# EAGLE design touch4 (EAGLE 7.2.0)
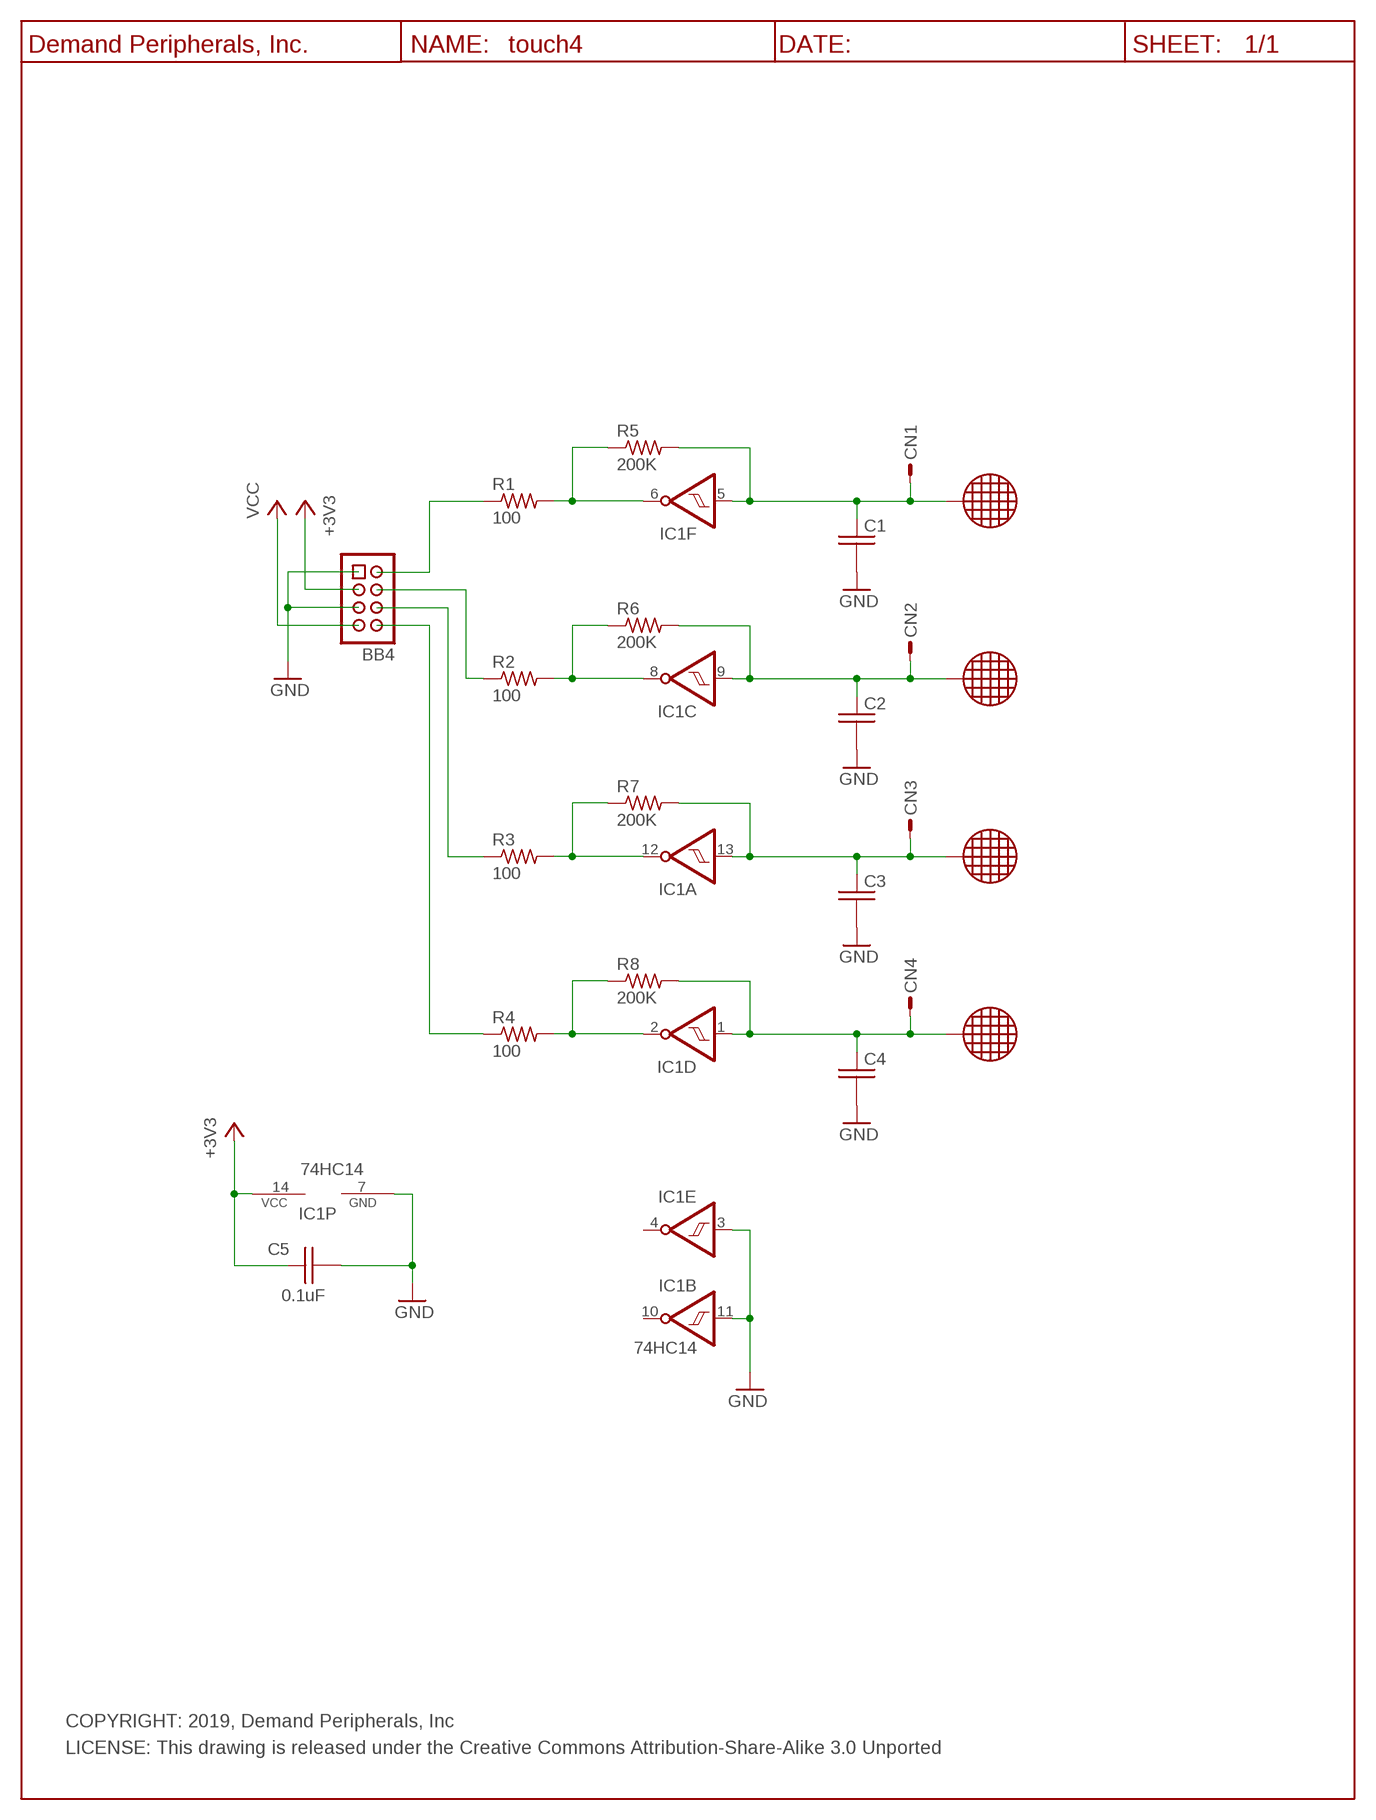
[diagram p0: schematic, sheet 1]

## Parts
BB4  BB_CON  HDR-4X2-SHR  [HDR-4X2]
C1  C33PF_C0603  [C0603]
C2  C33PF_C0603  [C0603]
C3  C33PF_C0603  [C0603]
C4  C33PF_C0603  [C0603]
C5  0.1uF  C0.1UF_C0603  [C0603]
CN1  PAD1  [PAD1]
CN2  PAD1  [PAD1]
CN3  PAD1  [PAD1]
CN4  PAD1  [PAD1]
IC1  74HC14  7414  [SO14]
R1  100  R100_R0603  [R0603]
R2  100  R100_R0603  [R0603]
R3  100  R100_R0603  [R0603]
R4  100  R100_R0603  [R0603]
R5  200K  R200K_R0603  [R0603]
R6  200K  R200K_R0603  [R0603]
R7  200K  R200K_R0603  [R0603]
R8  200K  R200K_R0603  [R0603]
U$1  DP_FRAME_P  [P_FRAME]
U$5  TOUCH-9MM  [TOUCH-9MM]
U$6  TOUCH-9MM  [TOUCH-9MM]
U$7  TOUCH-9MM  [TOUCH-9MM]
U$9  TOUCH-9MM  [TOUCH-9MM]

## Nets
+3V3: BB4.3 C5.1 IC1.14(P:VCC)
GND: BB4.1 BB4.5 C1.2 C2.2 C3.2 C4.2 C5.2 IC1.3(E:I) IC1.7(P:GND) IC1.11(B:I)
N$1: C3.1 CN3.1 IC1.13(A:I) R7.2 U$7.1
N$2: BB4.8 R4.1
N$3: BB4.2 R1.1
N$4: BB4.4 R2.1
N$7: BB4.6 R3.1
N$8: IC1.6(F:O) R1.2 R5.1
N$9: IC1.8(C:O) R2.2 R6.1
N$10: IC1.12(A:O) R3.2 R7.1
N$11: IC1.2(D:O) R4.2 R8.1
N$12: C4.1 CN4.1 IC1.1(D:I) R8.2 U$9.1
N$13: C1.1 CN1.1 IC1.5(F:I) R5.2 U$5.1
N$14: C2.1 CN2.1 IC1.9(C:I) R6.2 U$6.1
VCC: BB4.7
Unconnected: IC1.4(E:O) IC1.10(B:O)

## Notes on the sheet
- COPYRIGHT: 2019, Demand Peripherals, Inc
- LICENSE: This drawing is released under the Creative Commons Attribution-Share-Alike 3.0 Unported

## Library data of the parts
BB4 = dpi-conn:HDR-4X2-SHR: Shrouded 4x2 pin header; VENDOR: Digikey; VENDOR-PART-NUM: 609-3530-ND
C1-C4 = dpi-passive:C33PF_: 33 pF Capacitor, 50V; VENDOR: Digikey; VENDOR-PART-NUM: 1276-1070-2-ND
C5 = dpi-passive:C0.1UF_: 0.1 uF Capacitor, 25V, X7R; VENDOR: Digikey; VENDOR-PART-NUM: 1276-1126-2-ND
CN1-CN4 = dpi-conn:PAD1: WW PAD
IC1 = dpi-transic:74*14: Hex schmitt trigger INVERTER; VENDOR: Digikey; VENDOR-PART-NUM: 568-1401-1-ND
R1-R4 = dpi-passive:R100_: 100 Ohm resistor, 1%, 0.1 watt; VENDOR: Digikey; VENDOR-PART-NUM: 311-100HRTR-ND
R5-R8 = dpi-passive:R200K_: 200K Resistor, 1%, 0.1 watt; VENDOR: Digikey; VENDOR-PART-NUM: 311-200KHRTR-ND
U$1 = dpi-sym:DP_FRAME_P: Portrait/Letter Document Frame
U$5-U$7 U$9 = dpi-swsens:TOUCH-9MM: Touch Pad - 9mm

## Board
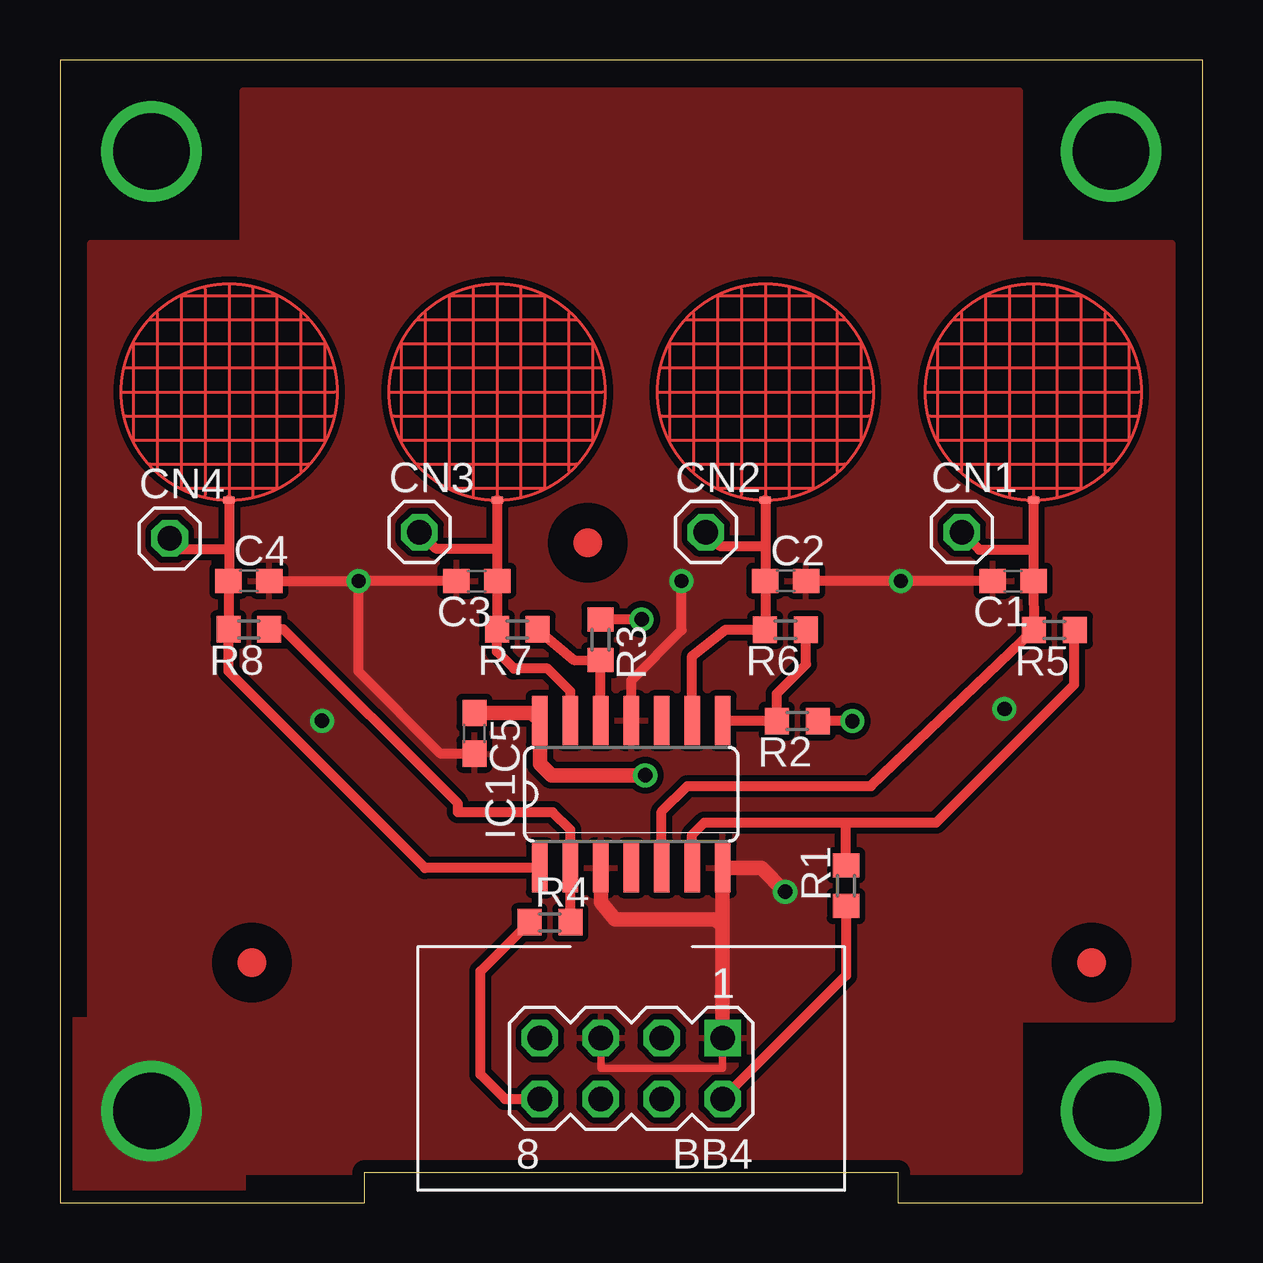
[diagram p1: board, top side]
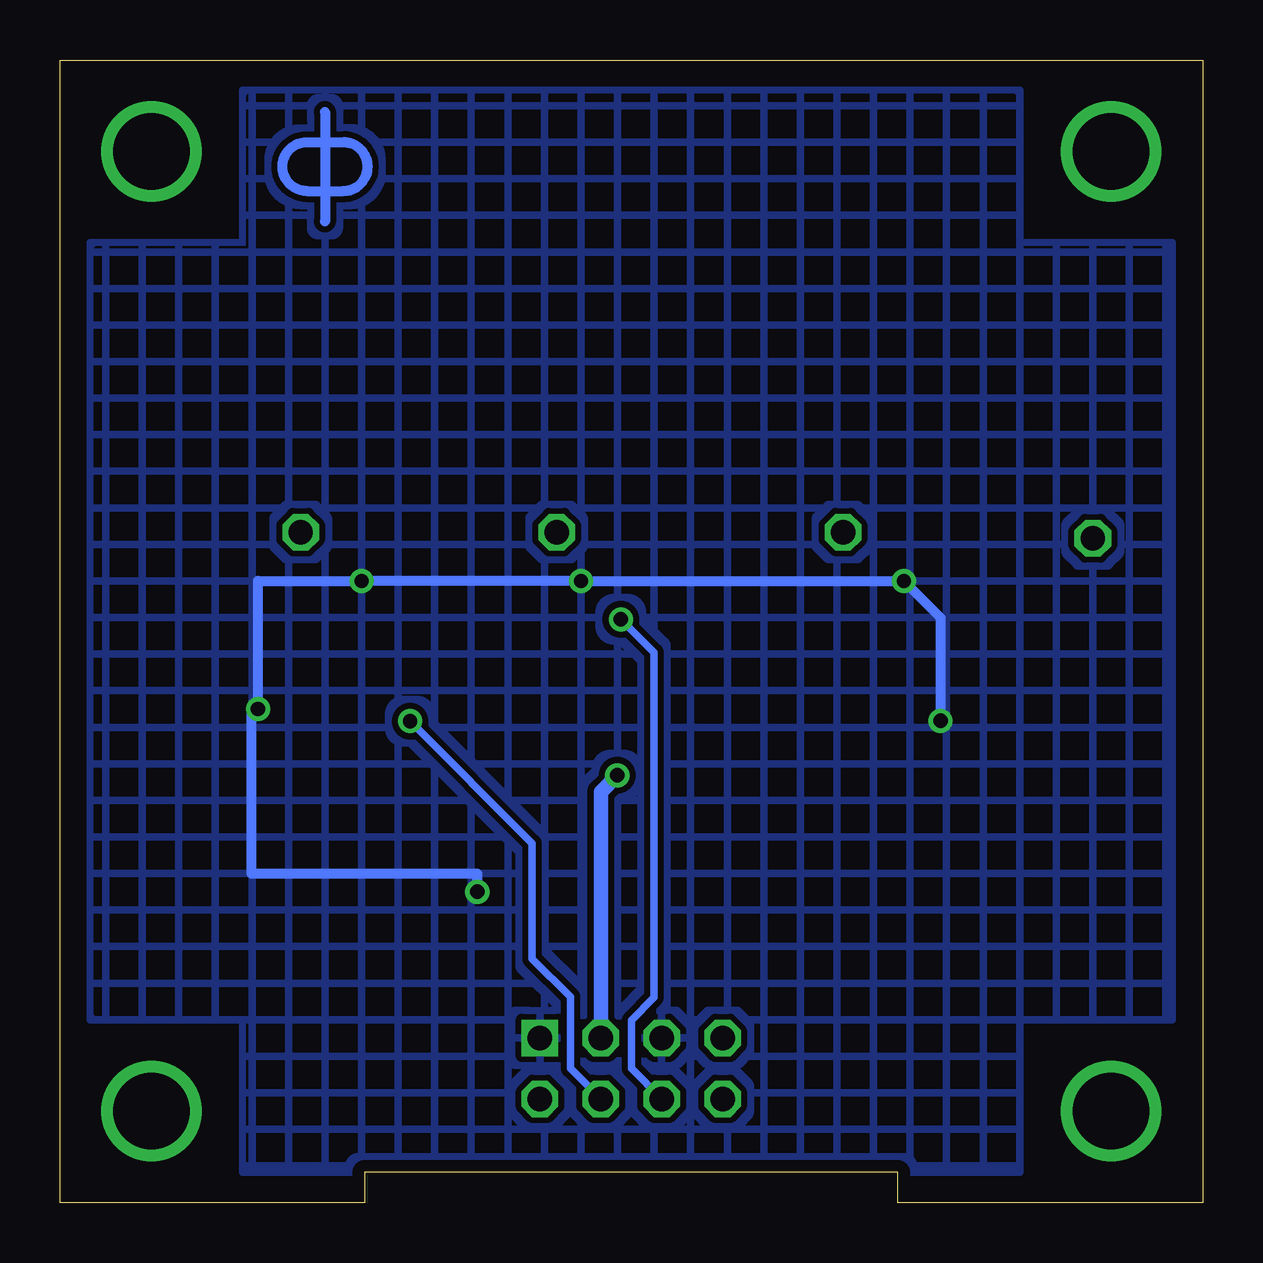
[diagram p2: board, bottom side, seen from below]

Size 47.62 x 47.62 mm. Coordinates in mm from the lower left corner, seen from the top.
Outline: 0,0 12.7,0 12.7,1.27 34.92,1.27 34.92,0 47.62,0 47.62,47.62 0,47.62 0,0
Copper layers (1*16): Top 0.035mm / dielectric 1.5mm / Bottom 0.035mm
Design rules "default *": minimum track width 10mil, minimum drill 20mil, track to track 10mil, track to pad 10mil, pad to pad 10mil, via to via 10mil, smd to smd 10mil, copper to edge 20mil, drill to drill 8mil, minimum pad ring 10mil, minimum via ring 8mil, stop-mask expansion 4mil, vias tented up to drill 0mil, thermal gap 10mil
tKeepout: area 15.1,1 to 32.5,9.7

### Footprints (pad centres in the part's own frame; a part is rotated, then mirrored left to right if it is on the bottom)
HDR-4X2 = drill 1.016 square: 1 -3.81,-1.27 | drill 1.016 octagon: 2 -3.81,1.27; 3 -1.27,-1.27; 4 -1.27,1.27; 5 1.27,-1.27; 6 1.27,1.27; 7 3.81,-1.27; 8 3.81,1.27
C0603 = smd 1.1 x 1: 1 -0.85,0; 2 0.85,0
PAD1 = drill 1.016 octagon: 1 0,0
SO14 = smd 0.66 x 2.032: 1 -3.81,-3.073; 2 -2.54,-3.073; 3 -1.27,-3.073; 4 0,-3.073; 5 1.27,-3.073; 6 2.54,-3.073; 7 3.81,-3.073; 8 3.81,3.073; 9 2.54,3.073; 10 1.27,3.073; 11 0,3.073; 12 -1.27,3.073; 13 -2.54,3.073; 14 -3.81,3.073
R0603 = smd 1 x 1.1: 1 -0.85,0; 2 0.85,0
TOUCH-9MM = smd 0.3 x 0.5: 1 -4.5,0

### Placement (x,y rotation side)
BB4  23.81,5.59 180 top
C1  39.73,25.91 180 top
C2  30.25,25.91 0 top
C3  17.37,25.91 180 top
C4  7.87,25.91 0 top
C5  17.27,19.56 270 top
CN1  37.59,27.94 0 top
CN2  26.92,27.94 0 top
CN3  14.99,27.94 0 top
CN4  4.57,27.69 0 top
IC1  23.81,17.02 0 top
R1  32.77,13.21 90 top
R2  30.73,20.07 180 top
R3  22.53,23.46 270 top
R4  20.42,11.68 0 top
R5  41.45,23.86 180 top
R6  30.24,23.88 180 top
R7  19.06,23.89 180 top
R8  7.87,23.89 180 top
U$1  -2.54,-2.54 0 top
U$2  [FIDUCIAL]  22,27.5 0 top
U$3  [FIDUCIAL]  8,10 0 top
U$4  [DPI-1]  36.58,43.18 0 bottom
U$5  40.58,33.78 90 top
U$6  29.4,33.78 90 top
U$7  18.22,33.78 90 top
U$8  [FIDUCIAL]  43,10 0 top
U$9  7.05,33.78 90 top

### Tracks (layer width: path | path; a pad name or v marks a point on that pad's centre or on a via)
+3V3  (via drill 0.6)
  Top 0.61: C5.1 19.69,20.41 IC1.14 20,18.29 20.48,17.8 v24.4,17.8
  Bottom 0.61: BB4.3 25.08,17.12 v24.4,17.8
GND  (via drill 0.6, 3.17)
  Top 0.305: BB4.1 27.62,5.59 22.54,5.59 BB4.5
  Top 0.406: IC1.11 23.81,21.77 25.91,23.86 v25.91,25.91 | C1.2 v35.05,25.91 C2.2 | C4.2 v12.45,25.91 | C3.2 v12.45,25.91 | C5.2 15.87,18.71 12.45,22.14 v12.45,25.91
  Top 0.61: BB4.1 27.62,11.56 | 27.62,11.56 IC1.7 29.23,13.95 v30.23,12.95 | IC1.3 22.54,12.51 23.14,11.81 27.27,11.81 27.62,11.56
  Bottom 0.406: v10.92,20.08 10.92,24.38 v12.45,25.91 v25.91,25.91 v35.05,25.91 39.37,25.91 v39.37,20.57 39.64,20.57 39.64,13.7 30.23,13.7 v30.23,12.95
  other vias: 3.81,3.81
  pour Bottom (hatched): 1.27,7.62 1.27,40.01 7.62,40.01 7.62,46.35 40.01,46.35 40.01,40.01 46.35,40.01 46.35,7.62 40.01,7.62 40.01,1.27 7.62,1.27 7.62,7.62
  pour Top (isolate 0.254): 1.27,40.01 7.62,40.01 7.62,46.35 40.01,46.35 40.01,40.01 46.35,40.01 46.35,7.62 40.01,7.62 40.01,1.27 7.62,1.27 7.62,0.51 0.51,0.51 0.51,7.62 1.27,7.62
MOUNT2  (via drill 3.17)
  other vias: 43.81,43.81
MOUNT3  (via drill 3.17)
  other vias: 43.81,3.81
MOUNT4  (via drill 3.17)
  other vias: 3.81,43.81
N$1
  Top 0.305: 18.22,24.14 R7.2
  Top 0.406: U$7.1 18.22,27.27 | 18.22,27.27 C3.1 | C3.1 | C3.1 18.22,24.14 R7.2 18.21,24.13 18.21,22.96 18.92,22.25 20.33,22.25 21.27,21.31 IC1.13 | CN3.1 15.66,27.27 18.22,27.27
N$2
  Top 0.406: R4.1 17.53,9.64 17.53,5.33 18.54,4.32 BB4.8
N$3
  Top 0.406: R1.1 32.77,9.46 BB4.2
N$4  (via drill 0.6)
  Top 0.406: v33.03,20.07 R2.1
  Bottom 0.305: BB4.4 26.35,5.59 26.35,7.61 26.35,8.57 27.94,10.16 27.94,14.97 v33.03,20.07
N$7  (via drill 0.6)
  Top 0.406: v24.24,24.31 R3.1
  Bottom 0.305: BB4.6 23.81,5.59 23.81,7.59 22.86,8.55 22.86,10.16 22.86,22.92 v24.24,24.31
N$8
  Top 0.406: IC1.6 26.35,15.33 26.86,15.84 32.77,15.84 | R5.1 42.28,24.13 42.28,21.59 36.52,15.84 32.93,15.84 32.77,15.84 | R1.2 32.77,15.84
N$9
  Top 0.406: 31.1,24.13 R6.1 31.1,22.43 29.88,21.21 R2.2 29.86,20.09 IC1.8
N$10
  Top 0.406: R7.1 21.45,22.59 R3.2 22.53,20.1 IC1.12
N$11
  Top 0.406: R4.2 IC1.2 21.27,15.53 20.54,16.27 16.59,16.27 16.59,16.62 9.32,23.89 R8.1
N$12
  Top 0.406: U$9.1 7.05,27.24 | 7.05,27.24 7.05,25.93 C4.1 R8.2 7.02,24.13 7.02,22.14 15.21,13.95 IC1.1 | CN4.1 5.02,27.24 7.05,27.24
N$13
  Top 0.305: 40.58,25.92 C1.1 | 40.58,24.13 R5.2
  Top 0.406: IC1.5 25.08,16.29 26.15,17.36 33.81,17.36 R5.2 C1.1 40.58,27.22 | U$5.1 40.58,27.22 | CN1.1 38.32,27.22 40.58,27.22
N$14
  Top 0.305: 29.4,24.13 R6.2
  Top 0.406: U$6.1 29.4,27.37 | 29.4,27.37 C2.1 | C2.1 | C2.1 29.4,24.13 R6.2 27.75,23.88 26.35,22.78 IC1.9 | CN2.1 27.5,27.37 29.4,27.37

### Text on the board
tTest: 1.875 Inches | 1.575 Inches | (C) 2019, Demand Peripherals, Inc. | TOUCH4, Rev 19A | 4 | 3 | 2 | 1 | C4 | C3 | C2 | C1 | R8 | R7 | R3 | R6 | R5 | C5 | R2 | 1.575 Inches | 1.875 Inches | IC1 | R1 | R4 | BB4